# Altium schematic sheet pre_amp.SchDoc
size A4; SheetNumber: 2; SheetTotal: 6
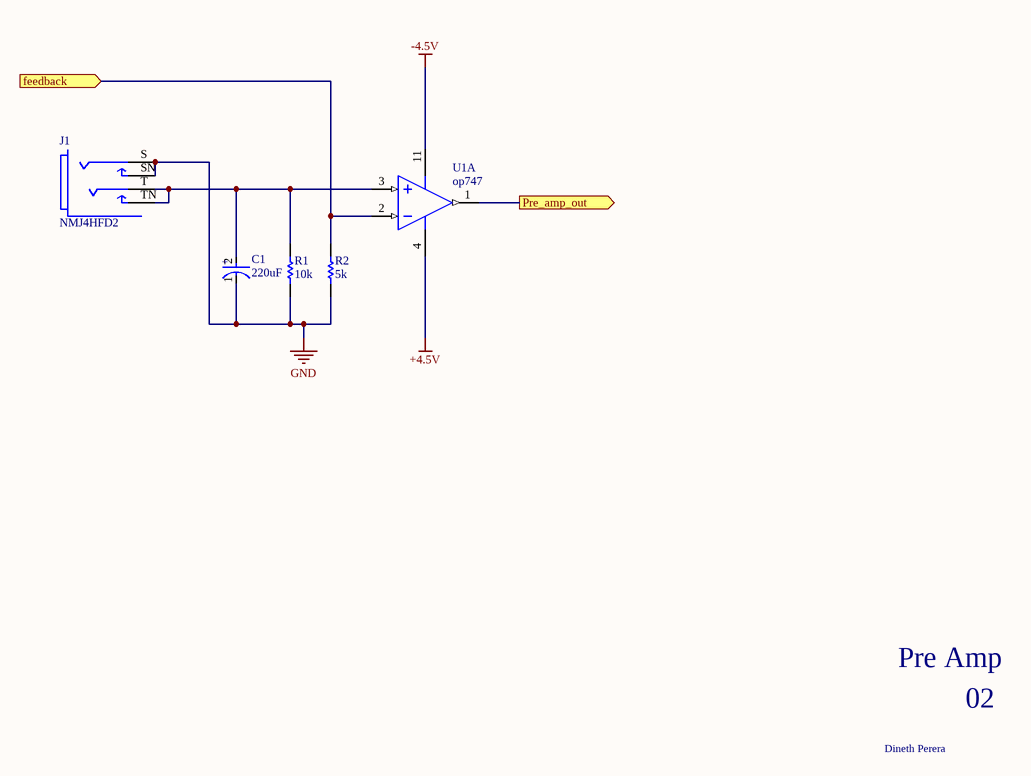
[diagram p0: pre_amp.SchDoc]

## Parts
C1  220uF  [FP-FTF-MFG]
J1  NMJ4HFD2  [FP-NMJ4HFD2-MFG]
R1  10k  [RESC2013X60X35NL10T20]
R2  5k  [RESC2013X50X30ML20T20]
U1  op747  [ADI-R-14_N]  (part A of 4)

## Ports
feedback (in), Pre_amp_out (out)

## Nets
+4.5V: U1.4(+V)
-4.5V: U1.11(-V)
GND: C1.1(C) J1.S J1.SN R1.1 R2.1
feedback: R2.2 U1.2(-IN_A) ; port feedback
Pre_amp_out: U1.1(OUT_A) ; port Pre_amp_out
NetC1_2: C1.2(A) J1.T J1.TN R1.2 U1.3(+IN_A)

## Notes on the sheet
- Pre Amp
- 02
- Dineth Perera
- (in symbol CMP-05427-000092-1) +

## Library data of the parts
C1 = CMP-05427-000092-1: CAP ALUM 220UF 20% 50V SMD; Ripple Current (AC): 670mA; Dielectric Material: Aluminium; Life (Hours): 2000Hour; Leakage Current: 110uA; Lead Diameter: 0.9mm; ESR (Equivalent Series Resistance): 180mR; REACH SVHC: No SVHC; Voltage Rating (DC): 50V; Radiation Hardening: No; Capacitance: 220uF; Length: 10.2mm; Construction: Cylindrical; Case/Package: Radial; Series: FT; Lead Free: Lead Free; Voltage Rating: 50V; Tolerance: 20%; Contact Plating: Tin; Number of Pins: 2; Height - Seated (Max): 0.413inch; RoHS Compliant: Yes; Diameter: 8mm; Ripple Current: 670mA; Lead Pitch: 3.1mm; Termination: SMD/SMT; Mount: Surface Mount; Min Operating Temperature: -55°C; Max Operating Temperature: 105°C; Voltage: 50V; Height: 10.2mm; Package Quantity: 500; Packaging: Tape and Reel
J1 = CMP-78736-000001-1: Conn 1/4" Mono Jack F 3 POS Solder RA Thru-Hole 3 Terminal 1 Port; Manufacturer: Neutrik; Number Of Contacts: 2; Current Rating: 0.5A; Voltage Rating: 50V; Conn Orientation: Horizontal; Is Female: yes; Temperature: -25°C to +70°C; ComponentLink2Description: Datasheet; ComponentLink2URL: https://www.neutrik.com/en/product/nmj4hfd2.pdf; Contact Material: Silver; Height: 15.89mm; Package: 0; Mouser Description: Phone Audio Connector, Socket, 2, PCB Mount, Metal Body, Silver Plated Contacts; Manufacturer Part Number: NMJ4HFD2; Automotive: No; RoHS: TRUE; Lead Free: Yes; Device Class L2: Audio / Video Connectors; Device Class L3: unset; Temperature Range Low: -25°C; Category: Conn; Footprint Url: https://www.neutrik.com/media/8576/download/st-nmj4hfd2.pdf?v=1; Temperature Range High: +70°C; Device Class L1: Connectors; Octopart: https://octopart.com/nmj4hfd2-neutrik-758952
R1 = CMP-1659-00013-4: Chip Resistor, 10 KOhm, +/- 1%, 0.125 W, -55 to 155 degC, 0805 (2012 Metric), RoHS, Tape and Reel; Manufacturer: Yageo; Voltage Rating: 150 V; Mount: Surface Mount; ComponentLink1Description: Manufacturer URL; ComponentLink2URL: http://www.yageo.com/documents/recent/PYu-RC_Group_51_RoHS_L_04.pdf; Pins: 2; Length: 2 mm; Min Operating Temperature: -55 degC; Height: 0.5 mm; Mounting Technology: Surface Mount; RoHSCompliant: true; REACH SVHC: No SVHC; ComponentLink1URL: http://www.yageo.com/; Max Operating Temperature: 155 degC; PackageReference: 0805; DatasheetVersion: Rev. 4, 02/2016; Package Quantity: 5000; Packaging: Tape and Reel; ComponentLink2Description: Datasheet; PackageDescription: 2-Pin Surface Mounted Device, Body 2 x 1.25 mm
R2 = CMP-2001-04239-1: Part Number: CRCW08055K00FKTA; Manufacturer: Vishay Dale
U1 = CMP-0384-00387-1: Quad Channel Rail-to-Rail Operational Amplifier, 700 KHz BW, 200 mV/us SR, Industrial, 14-pin SOIC (R-14), Reel; Manufacturer: Analog Devices; PartNumber: OP747ARZ-REEL7; Input Bias Current: 5.5nA; Input Offset Voltage: 30uV; Small Signal Bandwidth: 700KHz; V Span Min: 3V; V Span Max: 36V; Amplifiers Per Package: 4; Iq/Amp: 290uA; DatasheetVersion: Rev. D; Mounting Technology: Surface Mount; ComponentLink1URL: http://www.analog.com/en/index.html; PackageVersion: 060606-A; ComponentLink2Description: Datasheet; ComponentLink2URL: http://www.analog.com/static/imported-files/data_sheets/OP777_727_747.pdf; PackageDescription: 14-Pin Standard Small Outline Package, Body 8.65 x 3.9 mm, Pitch 1.27 mm; PackageReference: R-14; ComponentLink3URL: http://www.analog.com/static/imported-files/packages/PKG_PDF/SOIC_Narrow%20(R)/R_14.pdf; Generic Part Number: OP747; ComponentLink3Description: Package Specification; Slew Rate: 200mV/us; ComponentLink1Description: Manufacturer URL; Code_JEDEC: MS-012-AB